# Altium project Light.PrjPCB
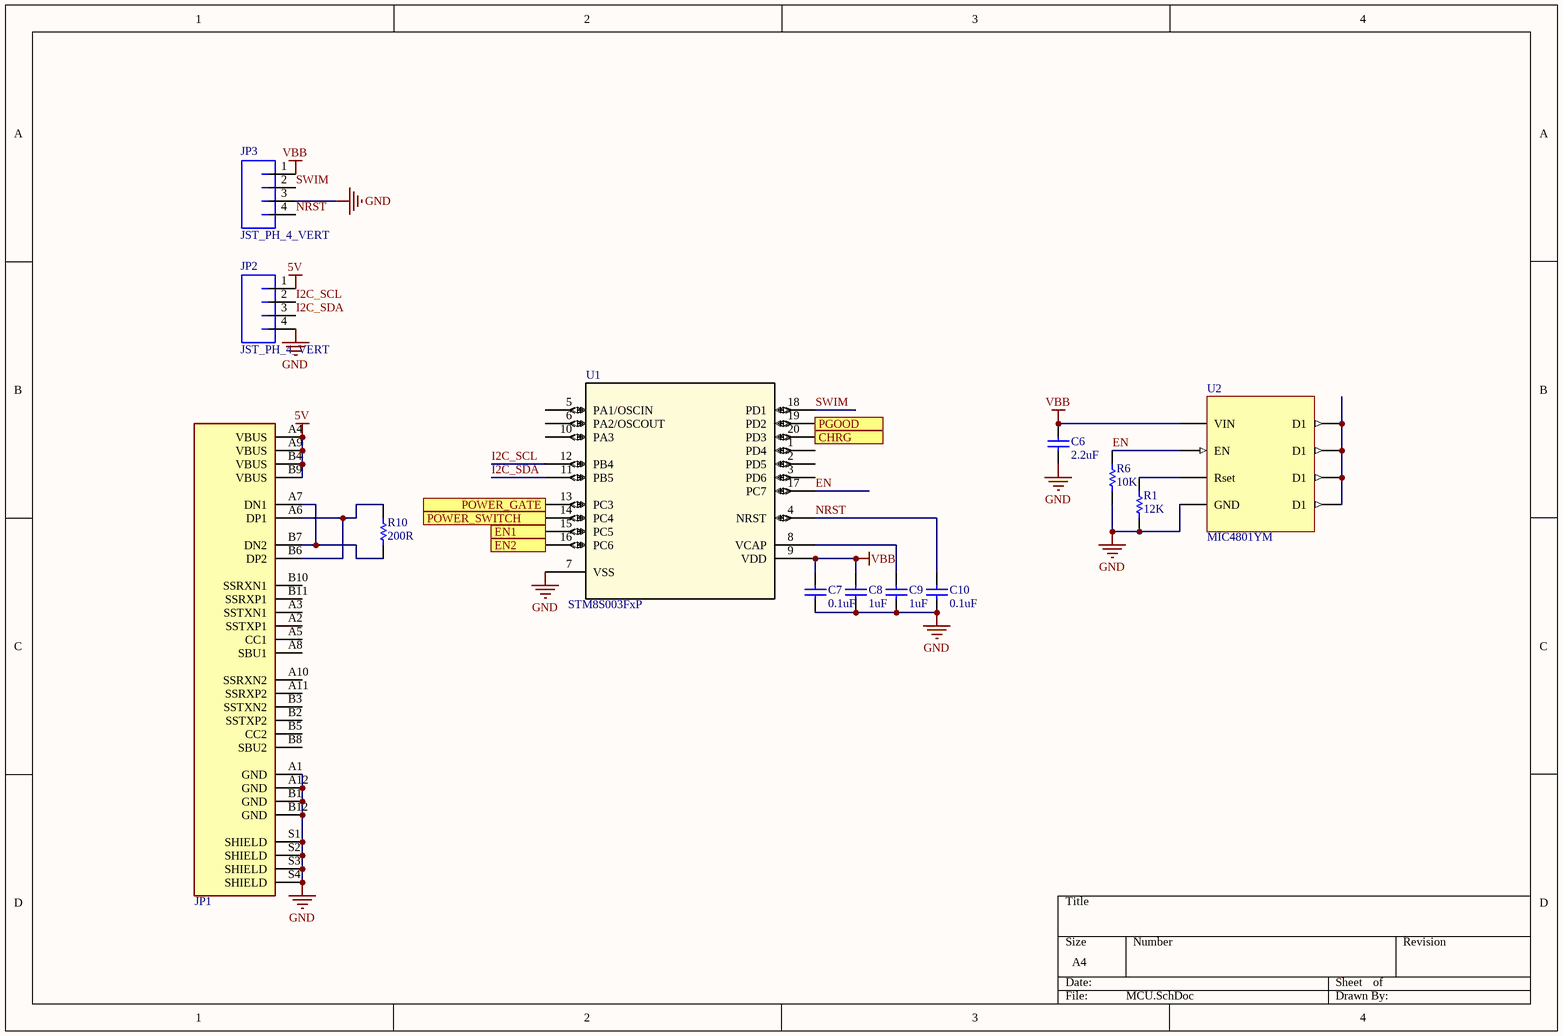
[diagram p0: MCU.SchDoc]
2 sheets, 40 parts. Net scope: flat (ports and power ports of the same name join across sheets).
Board file: Light.PcbDoc
Sheets:
  MCU.SchDoc
  Power.SchDoc

## Sheet MCU.SchDoc
size A4

### Parts
C6  value 2.2uF  [C0603[1608X92]]  (hidden comment: 2.2uF 6.3V 0603)
C7  value 0.1uF  [C0603[1608X92]]  (hidden comment: 0.1uF 6.3V 0603)
C8  value 1uF  [C0603[1608X92]]  (hidden comment: 1uF 6.3V 0603)
C9  value 1uF  [C0603[1608X92]]  (hidden comment: 1uF 6.3V 0603)
C10  value 0.1uF  [C0603[1608X92]]  (hidden comment: 0.1uF 6.3V 0603)
JP1  UJ31-CH-3-MSMT-TR-67  [CUI_UJ31-CH-3-MSMT-TR-67]  (value not drawn)
JP2  JST_PH_4_VERT  [JST-PH-4-PTH-VERT]
JP3  JST_PH_4_VERT  [JST-PH-4-PTH-VERT]
R1  value 12K  [R0603[1608]]  (hidden comment: 12K 1% 0603)
R6  value 10K  [R0603[1608]]  (hidden comment: 10K 1% 0603)
R10  value 200R  [R0603[1608]]  (hidden comment: 200R 1% 0603)
U1  STM8S003FxP  [TSSOP-20]
U2  MIC4801YM  [SOIC-8]

### Ports
CHRG (in), EN1 (in), EN2 (in), PGOOD (in), POWER_GATE (out), POWER_SWITCH (in)

### Nets
5V: JP1.A4(VBUS) JP1.A9(VBUS) JP1.B4(VBUS) JP1.B9(VBUS) JP2.1
GND: C6.1 C7.1 C8.2 C9.2 C10.1 JP1.A1(GND) JP1.A12(GND) JP1.B1(GND) JP1.B12(GND) JP1.S1(SHIELD) JP1.S2(SHIELD) JP1.S3(SHIELD) JP1.S4(SHIELD) JP2.4 JP3.3 R1.1 R6.1 U1.7(VSS) U2.4(GND)
VBB: C6.2 C7.2 C8.1 JP3.1 U1.9(VDD) U2.1(VIN)
EN: R6.2 U1.17(PC7) U2.2(EN)
I2C_SCL: JP2.2 U1.12(PB4)
I2C_SDA: JP2.3 U1.11(PB5)
NRST: C10.2 JP3.4 U1.4(NRST)
Power_switch: U1.14(PC4) ; port POWER_SWITCH
SWIM: JP3.2 U1.18(PD1)
NetC9_1: C9.1 U1.8(VCAP)
NetJP1_A6: JP1.A6(DP1) JP1.B6(DP2) R10.2
NetJP1_A7: JP1.A7(DN1) JP1.B7(DN2) R10.1
NetQ2_1: U1.13(PC3) ; port POWER_GATE
NetR1_2: R1.2 U2.3(Rset)
NetR2_1: U1.20(PD3) ; port CHRG
NetR3_1: U1.19(PD2) ; port PGOOD
NetU1_15: U1.15(PC5) ; port EN1
NetU1_16: U1.16(PC6) ; port EN2
NetU2_5: U2.5(D1) U2.6(D1) U2.7(D1) U2.8(D1)

Not connected (* = marked no-connect by the designer): JP1 A2(SSTXP1) A3(SSTXN1) A5(CC1) A8(SBU1) A10(SSRXN2) A11(SSRXP2) B2(SSTXP2) B3(SSTXN2) B5(CC2) B8(SBU2) B10(SSRXN1) B11(SSRXP1); U1 1(PD4) 2(PD5) 3(PD6) 5(PA1/OSCIN) 6(PA2/OSCOUT) 10(PA3)

### Library data of the parts
C6 = CAP_2.2uF_6.3V_0603_10%: 2.2uF 6.3V 10% 0603 (1608 Metric); PartNumber: GRM185R60J225KE26D; Manufacturer: Murata; TemperatureCoefficient: X5R; Mounting Technology: Surface Mount; PackageReference: 0603; PackageDescription: 0603 (1608 Metric); Voltage: 6.3V; Tolerance: 10%
C7 C10 = CAP_0.1uF_6.3V_0603_10%: 0.1uF 6.3V 10% 0603 (1608 Metric); PartNumber: GRM188R70J104KA01D; Manufacturer: Murata; Mounting Technology: Surface Mount; PackageReference: 0603; PackageDescription: 0603 (1608 Metric); Voltage: 6.3V; Tolerance: 10%
C8 C9 = CAP_1uF_6.3V_0603_10%: 1uF 6.3V 10% 0603 (1608 Metric); PartNumber: GRM188R60J105KA01D; Manufacturer: Murata; TemperatureCoefficient: X5R; Mounting Technology: Surface Mount; PackageReference: 0603; PackageDescription: 0603 (1608 Metric); Voltage: 6.3V; Tolerance: 10%
JP1 = UJ31-CH-3-MSMT-TR-67: Type C, USB 3.1 Gen 2, 5 A, Right Angle, Mid Mount _SMT_,  Waterproof, USB Receptacle; Manufacturer: CUI Devices; Package: Surface Mount, Through Hole; PartNumber: UJ31-CH-3-MSMT-TR
JP2 JP3 = JST_PH_4_VERT: PartNumber: B4B-PH-K-S(LF)(SN); Manufacturer: JST Sales America Inc.; PackageReference: JST-PH; Mounting Technology: Through Hole
R1 = RES_12K_0603_1%: 12K 0.25W 1% 0603 (1005 Metric); Manufacturer: Vishay; PartNumber: RCS060312K0FKEA; Tolerance: 1%; Power: 0.25W; Mounting Technology: Surface Mount; PackageReference: 0603; PackageDescription: 0603 (1608 Metric); ComponentLink1Description: Datasheet; ComponentLink1URL: http://www.vishay.com/docs/20065/rcse3.pdf
R6 = RES_10K_0603_1%: 10K 0.25W 1% 0603 (1005 Metric); Manufacturer: Vishay / Dale; PartNumber: CRCW060310K0FKEAHP; Tolerance: 1%; Power: 0.25W; Mounting Technology: Surface Mount; PackageReference: 0603; PackageDescription: 0603 (1608 Metric); ComponentLink1Description: Datasheet; ComponentLink1URL: http://www.vishay.com/docs/20065/rcse3.pdf
R10 = RES_200R_0603_1%: 200R 0.25W 1% 0603 (1005 Metric); Manufacturer: Vishay / Dale; PartNumber: CRCW0603200RFKEAHP; Tolerance: 1%; Power: 0.25W; Mounting Technology: Surface Mount; PackageReference: 0603; PackageDescription: 0603 (1608 Metric); ComponentLink1Description: Datasheet; ComponentLink1URL: http://www.vishay.com/docs/20043/crcwhpe3.pdf
U1 = STM8S003FxP: 8-bit MCU with 8 Kbytes Flash, 16 MHz CPU, integrated EEPROM; Manufacturer: STMicroelectronics; Part Number: STM8S003FxP; Mounting Technology: Surface Mount; PackageReference: TSSOP-20
U2 = MIC4801: 600mA Single Channel WLED Driver w/ Ultrafast PWM Control; Manufacturer: Microchips; PartNumber: MIC4801YM; Mounting Technology: Surface Mount; PackageReference: SOIC-8

## Sheet Power.SchDoc
size A; SheetNumber: 2
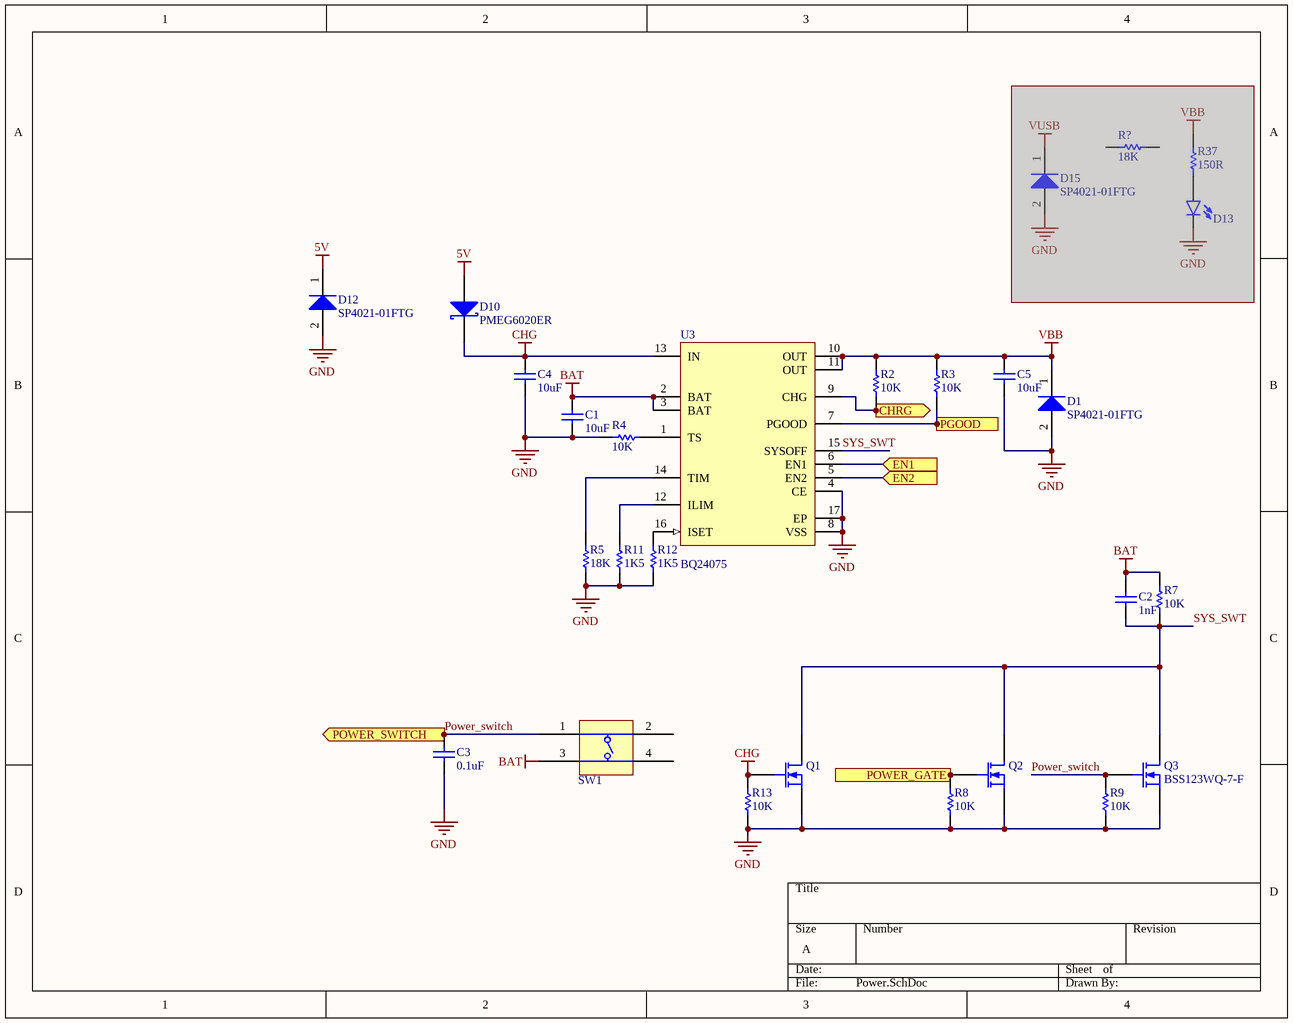
[diagram p1: Power.SchDoc]

### Parts
C1  value 10uF  [C1206[3216X160]]  (hidden comment: 10uF 50V 1206)
C2  value 1nF  [C0603[1608X92]]  (hidden comment: 1nF 50V 0603)
C3  value 0.1uF  [C0603[1608X92]]  (hidden comment: 0.1uF 6.3V 0603)
C4  value 10uF  [C1206[3216X160]]  (hidden comment: 10uF 50V 1206)
C5  value 10uF  [C1206[3216X160]]  (hidden comment: 10uF 50V 1206)
D1  SP4021-01FTG  [SOD-323]
D10  PMEG6020ER  [SOD-123]
D12  SP4021-01FTG  [SOD-323]
D13  LED_0603_GREEN_5mA  [LED0603]  (value not drawn)  (masked out: inside a compile mask, not in the netlist)
D15  SP4021-01FTG  [SOD-323]  (masked out: inside a compile mask, not in the netlist)
Q1  BSS123WQ-7-F  [SOT323-3]  (value not drawn)
Q2  BSS123WQ-7-F  [SOT323-3]  (value not drawn)
Q3  BSS123WQ-7-F  [SOT323-3]
R2  value 10K  [R0603[1608]]  (hidden comment: 10K 1% 0603)
R3  value 10K  [R0603[1608]]  (hidden comment: 10K 1% 0603)
R4  value 10K  [R0603[1608]]  (hidden comment: 10K 1% 0603)
R5  value 18K  [R0603[1608]]  (hidden comment: 18K 1% 0603)
R7  value 10K  [R0603[1608]]  (hidden comment: 10K 1% 0603)
R8  value 10K  [R0603[1608]]  (hidden comment: 10K 1% 0603)
R9  value 10K  [R0603[1608]]  (hidden comment: 10K 1% 0603)
R11  value 1K5  [R0603[1608]]  (hidden comment: 1K5 1% 0603)
R12  value 1K5  [R0603[1608]]  (hidden comment: 1K5 1% 0603)
R13  value 10K  [R0603[1608]]  (hidden comment: 10K 1% 0603)
R37  value 150R  [R0603[1608]]  (hidden comment: 150R 1% 0603)  (masked out: inside a compile mask, not in the netlist)
R?  value 18K  [R0603[1608]]  (hidden comment: 18K 1% 0603)  (masked out: inside a compile mask, not in the netlist)
SW1  DIPT-DTSM-6  [PTS810]  (value not drawn)
U3  BQ24075  [QFN-16]

### Ports
CHRG (out), EN1 (in), EN2 (in), PGOOD (out), POWER_GATE (in), POWER_SWITCH (out)

### Nets
5V: D10.2(A) D12.1(K)
BAT: C1.2 C2.2 R7.2 SW1.3 U3.2(BAT) U3.3(BAT)
CHG: C4.2 D10.1(K) Q1.1(G) R13.2 U3.13(IN)
GND: C1.1 C3.1 C4.1 C5.1 D1.2(A) D12.2(A) Q1.2(S) Q2.2(S) Q3.2(S) R4.2 R5.1 R8.1 R9.1 R11.1 R12.1 R13.1 U3.4(CE) U3.8(VSS) U3.17(EP)
VBB: C5.2 D1.1(K) R2.2 R3.2 U3.10(OUT) U3.11(OUT)
Power_switch: C3.2 Q3.1(G) R9.2 SW1.1 ; port POWER_SWITCH
SYS_SWT: C2.1 Q1.3(D) Q2.3(D) Q3.3(D) R7.1 U3.15(SYSOFF)
NetQ2_1: Q2.1(G) R8.2 ; port POWER_GATE
NetR2_1: R2.1 U3.9(CHG) ; port CHRG
NetR3_1: R3.1 U3.7(PGOOD) ; port PGOOD
NetR4_1: R4.1 U3.1(TS)
NetR5_2: R5.2 U3.14(TIM)
NetR11_2: R11.2 U3.12(ILIM)
NetR12_2: R12.2 U3.16(ISET)
NetU1_15: U3.6(EN1) ; port EN1
NetU1_16: U3.5(EN2) ; port EN2

Not connected (* = marked no-connect by the designer): SW1 2 4

### Library data of the parts
C1 C4 C5 = CAP_10uF_50V_1206_20%: 10uF 50V 20% 1206 (3216 Metric); PartNumber: UMK316BBJ106ML-T; Manufacturer: Taiyo Yuden; Mounting Technology: Surface Mount; PackageReference: 1206; PackageDescription: 1206 (3216 Metric); Voltage: 50V; Tolerance: 20%
C2 = CAP_1nF_50V_0603_5%: 1nF 50V 5% 0603 (1608 Metric); PartNumber: GRM1885C1H102JA01D; Manufacturer: Murata; TemperatureCoefficient: C0G; Mounting Technology: Surface Mount; PackageReference: 0603; PackageDescription: 0603 (1608 Metric); Voltage: 50V; Tolerance: 5%
C3 = CAP_0.1uF_6.3V_0603_10%: as C7 on sheet MCU; Mounting Technology: Surface Mount; PackageReference: 0603; PackageDescription: 0603 (1608 Metric); Voltage: 6.3V; Tolerance: 10%
D1 D12 D15 = SP4021-01FTG: Manufacturer: Littelfuse; PartNumber: SP4021-01FTG; PackageReference: SOD-323-2; Mounting Technology: Surface Mount
D10 = PMEG6020ER: PartNumber: PMEG6020ER,115; Manufacturer: NXP Semiconductors; PackageReference: SOD-123W; PackageDescription: SOD, 2-Leads, Body 2.69x1.6mm; Mounting Technology: Surface Mount
D13 = LED_0603_GREEN_5mA: PartNumber: LTST-C193TGKT-5A; Manufacturer: Lite-On Inc.; PackageReference: 0603; PackageDescription: 0603 (1608 Metric); Mounting Technology: Surface Mount
Q1-Q3 = BSS123WQ-7-F: N-Channel MOSFET; Manufacturer: Diodes Incorporated; PackageReference: SOT-323-3; PartNumber: BSS123WQ-7-F; Mounting Technology: Surface Mount
R2-R4 R7-R9 R13 = RES_10K_0603_1%: as R6 on sheet MCU; Tolerance: 1%; Power: 0.25W; Mounting Technology: Surface Mount; PackageReference: 0603; PackageDescription: 0603 (1608 Metric); ComponentLink1Description: Datasheet; ComponentLink1URL: http://www.vishay.com/docs/20065/rcse3.pdf
R5 R? = RES_18K_0603_1%: 18K 0.25W 1% 0603 (1005 Metric); Manufacturer: Vishay / Dale; PartNumber: CRCW060318K0FKEAHP; Tolerance: 1%; Power: 0.25W; Mounting Technology: Surface Mount; PackageReference: 0603; PackageDescription: 0603 (1608 Metric); ComponentLink1Description: Datasheet; ComponentLink1URL: http://www.vishay.com/docs/20043/crcwhpe3.pdf
R11 R12 = RES_1K5_0603_1%: 1K5 0.25W 1% 0603 (1005 Metric); Manufacturer: Vishay / Dale; PartNumber: CRCW06031K50FKEAHP; Tolerance: 1%; Power: 0.25W; Mounting Technology: Surface Mount; PackageReference: 0603; PackageDescription: 0603 (1608 Metric); ComponentLink1Description: Datasheet; ComponentLink1URL: http://www.vishay.com/docs/20043/crcwhpe3.pdf
R37 = RES_150R_0603_1%: 150R 0.25W 1% 0603 (1005 Metric); Manufacturer: Vishay / Dale; PartNumber: CRCW0603150RFKEAHP; Tolerance: 1%; Power: 0.25W; Mounting Technology: Surface Mount; PackageReference: 0603; PackageDescription: 0603 (1608 Metric); ComponentLink1Description: Datasheet; ComponentLink1URL: http://www.vishay.com/docs/20043/crcwhpe3.pdf
SW1 = DIPT-DTSM-6: Switch, SPNO Push Button SMD; Manufacturer: C&K Components; PartNumber: PTS810 SJM 250 SMTR LFS; PackageReference: PTS810
U3 = BQ24075: Standalone 1-Cell 1.5-A Linear Battery Charger with Power Path; Manufacturer: Texas Instruments; PartNumber: BQ24075; PackageReference: VQFN-16; Mounting Technology: Surface Mount

## Nets that join several sheets
5V: MCU (5 pins), Power (D10.2 D12.1)
GND: MCU (19 pins), Power (19 pins)
VBB: MCU (6 pins), Power (6 pins)
NetQ2_1: MCU (U1.13), Power (Q2.1 R8.2)
NetR2_1: MCU (U1.20), Power (R2.1 U3.9)
NetR3_1: MCU (U1.19), Power (R3.1 U3.7)
NetU1_15: MCU (U1.15), Power (U3.6)
NetU1_16: MCU (U1.16), Power (U3.5)
Power_switch: MCU (U1.14), Power (C3.2 Q3.1 R9.2 SW1.1)